# Altium schematic sheet BrakeLight.SchDoc
size A4; SheetNumber: 1; SheetTotal: 1
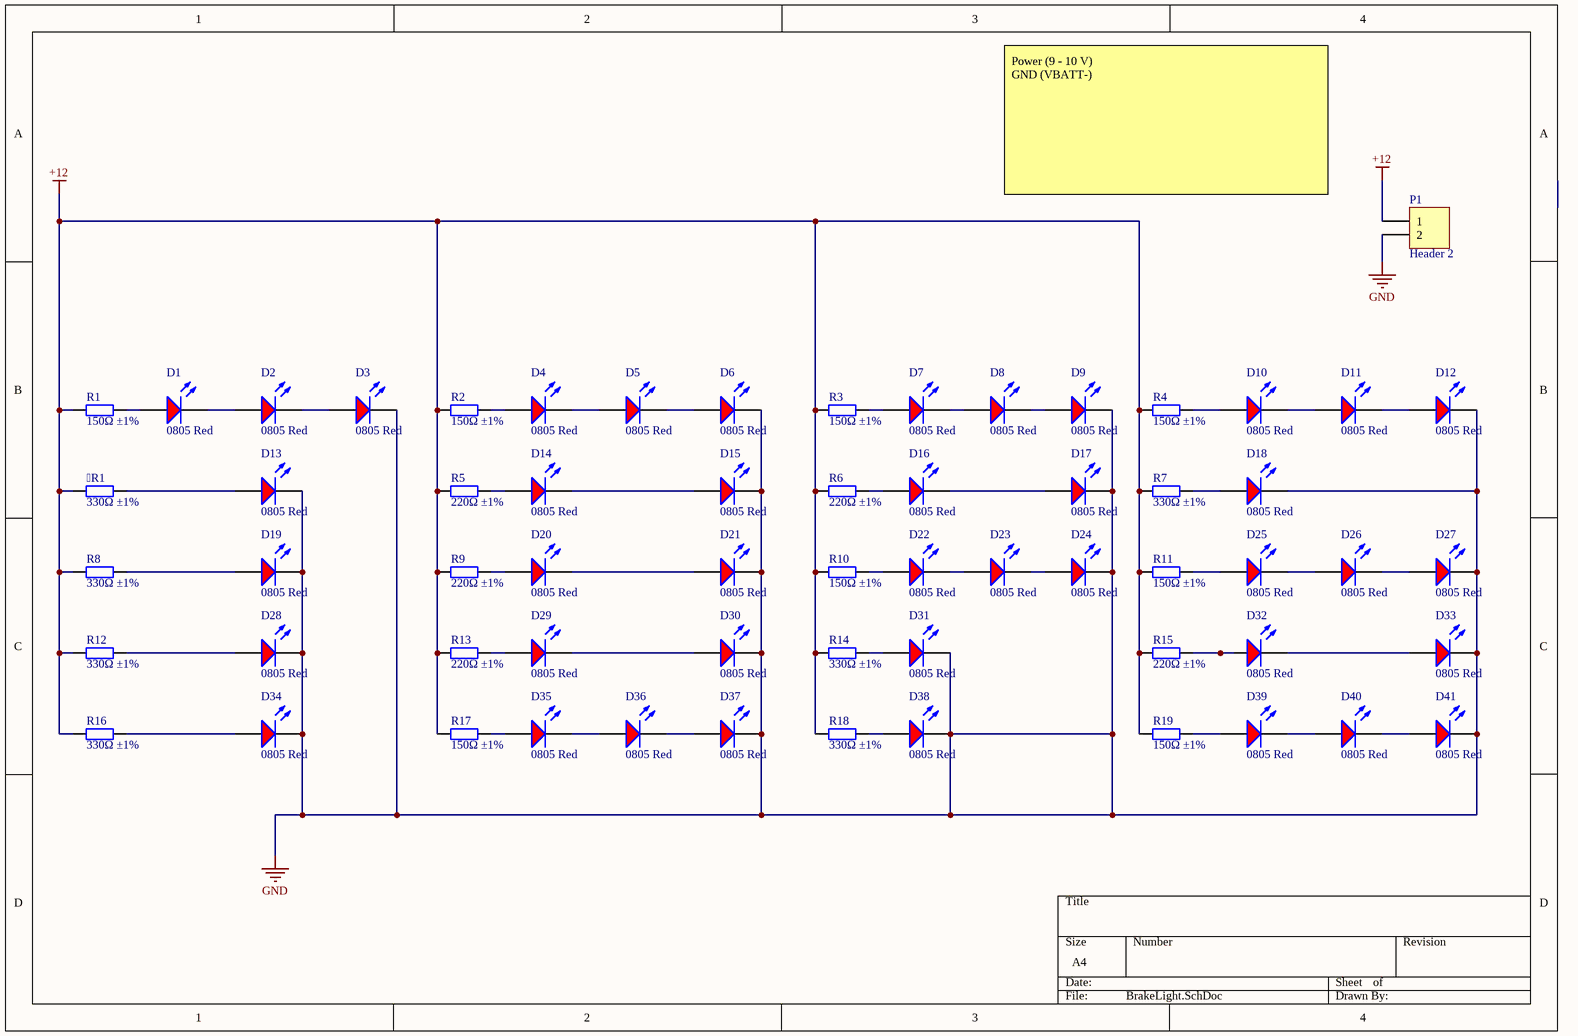
[diagram p0: BrakeLight.SchDoc]

## Parts
R1  330Ω ±1%  [0805_R]
D1  0805 Red  [0805_LED_S1]
D2  0805 Red  [0805_LED_S1]
D3  0805 Red  [0805_LED_S1]
D4  0805 Red  [0805_LED_S1]
D5  0805 Red  [0805_LED_S1]
D6  0805 Red  [0805_LED_S1]
D7  0805 Red  [0805_LED_S1]
D8  0805 Red  [0805_LED_S1]
D9  0805 Red  [0805_LED_S1]
D10  0805 Red  [0805_LED_S1]
D11  0805 Red  [0805_LED_S1]
D12  0805 Red  [0805_LED_S1]
D13  0805 Red  [0805_LED_S1]
D14  0805 Red  [0805_LED_S1]
D15  0805 Red  [0805_LED_S1]
D16  0805 Red  [0805_LED_S1]
D17  0805 Red  [0805_LED_S1]
D18  0805 Red  [0805_LED_S1]
D19  0805 Red  [0805_LED_S1]
D20  0805 Red  [0805_LED_S1]
D21  0805 Red  [0805_LED_S1]
D22  0805 Red  [0805_LED_S1]
D23  0805 Red  [0805_LED_S1]
D24  0805 Red  [0805_LED_S1]
D25  0805 Red  [0805_LED_S1]
D26  0805 Red  [0805_LED_S1]
D27  0805 Red  [0805_LED_S1]
D28  0805 Red  [0805_LED_S1]
D29  0805 Red  [0805_LED_S1]
D30  0805 Red  [0805_LED_S1]
D31  0805 Red  [0805_LED_S1]
D32  0805 Red  [0805_LED_S1]
D33  0805 Red  [0805_LED_S1]
D34  0805 Red  [0805_LED_S1]
D35  0805 Red  [0805_LED_S1]
D36  0805 Red  [0805_LED_S1]
D37  0805 Red  [0805_LED_S1]
D38  0805 Red  [0805_LED_S1]
D39  0805 Red  [0805_LED_S1]
D40  0805 Red  [0805_LED_S1]
D41  0805 Red  [0805_LED_S1]
P1  Header 2  [HDR1X2]
R1  150Ω ±1%  [0805_R]
R2  150Ω ±1%  [0805_R]
R3  150Ω ±1%  [0805_R]
R4  150Ω ±1%  [0805_R]
R5  220Ω ±1%  [0805_R]
R6  220Ω ±1%  [0805_R]
R7  330Ω ±1%  [0805_R]
R8  330Ω ±1%  [0805_R]
R9  220Ω ±1%  [0805_R]
R10  150Ω ±1%  [0805_R]
R11  150Ω ±1%  [0805_R]
R12  330Ω ±1%  [0805_R]
R13  220Ω ±1%  [0805_R]
R14  330Ω ±1%  [0805_R]
R15  220Ω ±1%  [0805_R]
R16  330Ω ±1%  [0805_R]
R17  150Ω ±1%  [0805_R]
R18  330Ω ±1%  [0805_R]
R19  150Ω ±1%  [0805_R]

## Nets
+12: R1.1 P1.1 R1.1 R2.1 R3.1 R4.1 R5.1 R6.1 R7.1 R8.1 R9.1 R10.1 R11.1 R12.1 R13.1 R14.1 R15.1 R16.1 R17.1 R18.1 R19.1
GND: D3.K D6.K D9.K D12.K D13.K D15.K D17.K D18.K D19.K D21.K D24.K D27.K D28.K D30.K D31.K D33.K D34.K D37.K D38.K D41.K P1.2
NetR1_2: R1.2 D13.A
NetD1_A: D1.A R1.2
NetD1_K: D1.K D2.A
NetD2_K: D2.K D3.A
NetD4_A: D4.A R2.2
NetD4_K: D4.K D5.A
NetD5_K: D5.K D6.A
NetD7_A: D7.A R3.2
NetD7_K: D7.K D8.A
NetD8_K: D8.K D9.A
NetD10_A: D10.A R4.2
NetD10_K: D10.K D11.A
NetD11_K: D11.K D12.A
NetD14_A: D14.A R5.2
NetD14_K: D14.K D15.A
NetD16_A: D16.A R6.2
NetD16_K: D16.K D17.A
NetD18_A: D18.A R7.2
NetD19_A: D19.A R8.2
NetD20_A: D20.A R9.2
NetD20_K: D20.K D21.A
NetD22_A: D22.A R10.2
NetD22_K: D22.K D23.A
NetD23_K: D23.K D24.A
NetD25_A: D25.A R11.2
NetD25_K: D25.K D26.A
NetD26_K: D26.K D27.A
NetD28_A: D28.A R12.2
NetD29_A: D29.A R13.2
NetD29_K: D29.K D30.A
NetD31_A: D31.A R14.2
NetD32_A: D32.A R15.2
NetD32_K: D32.K D33.A
NetD34_A: D34.A R16.2
NetD35_A: D35.A R17.2
NetD35_K: D35.K D36.A
NetD36_K: D36.K D37.A
NetD38_A: D38.A R18.2
NetD39_A: D39.A R19.2
NetD39_K: D39.K D40.A
NetD40_K: D40.K D41.A

## Notes on the sheet
- Power (9 - 10 V)
  GND (VBATT-)

## Library data of the parts
R1 R1-R19 = 0805 1K (1001) 1%: Chip resistor; Manufacturer: Uniroyal Elec; PartNumber: 0805W8F1001T5E; Power: 1/8W; Resistance: 1KΩ; ComponentLink1Description: Supplier link; ComponentLink1URL: http://www.szlcsc.com/product/details_18201.html; Package: 0805; Supplier: LC; SuppliersPartNumber: C17513; Tolerance: 1%
D1-D41 = 0805 LED Red: LED; PartNumber: FC-2012HRK-620D; Manufacturer: Foshan NationStar Optoelectronics; ComponentLink1Description: 供应商链接; ComponentLink1URL: http://www.szlcsc.com/product/details_2668.html; Package: 0805; Supplier: LC; SuppliersPartNumber: C84256; Color: Red
P1 = Header 2: Header, 2-Pin; LatestRevisionDate: 17-Jul-2002; LatestRevisionNote: Re-released for DXP Platform.; Publisher: Altium Limited